# Altium project MoBo.PrjPcb
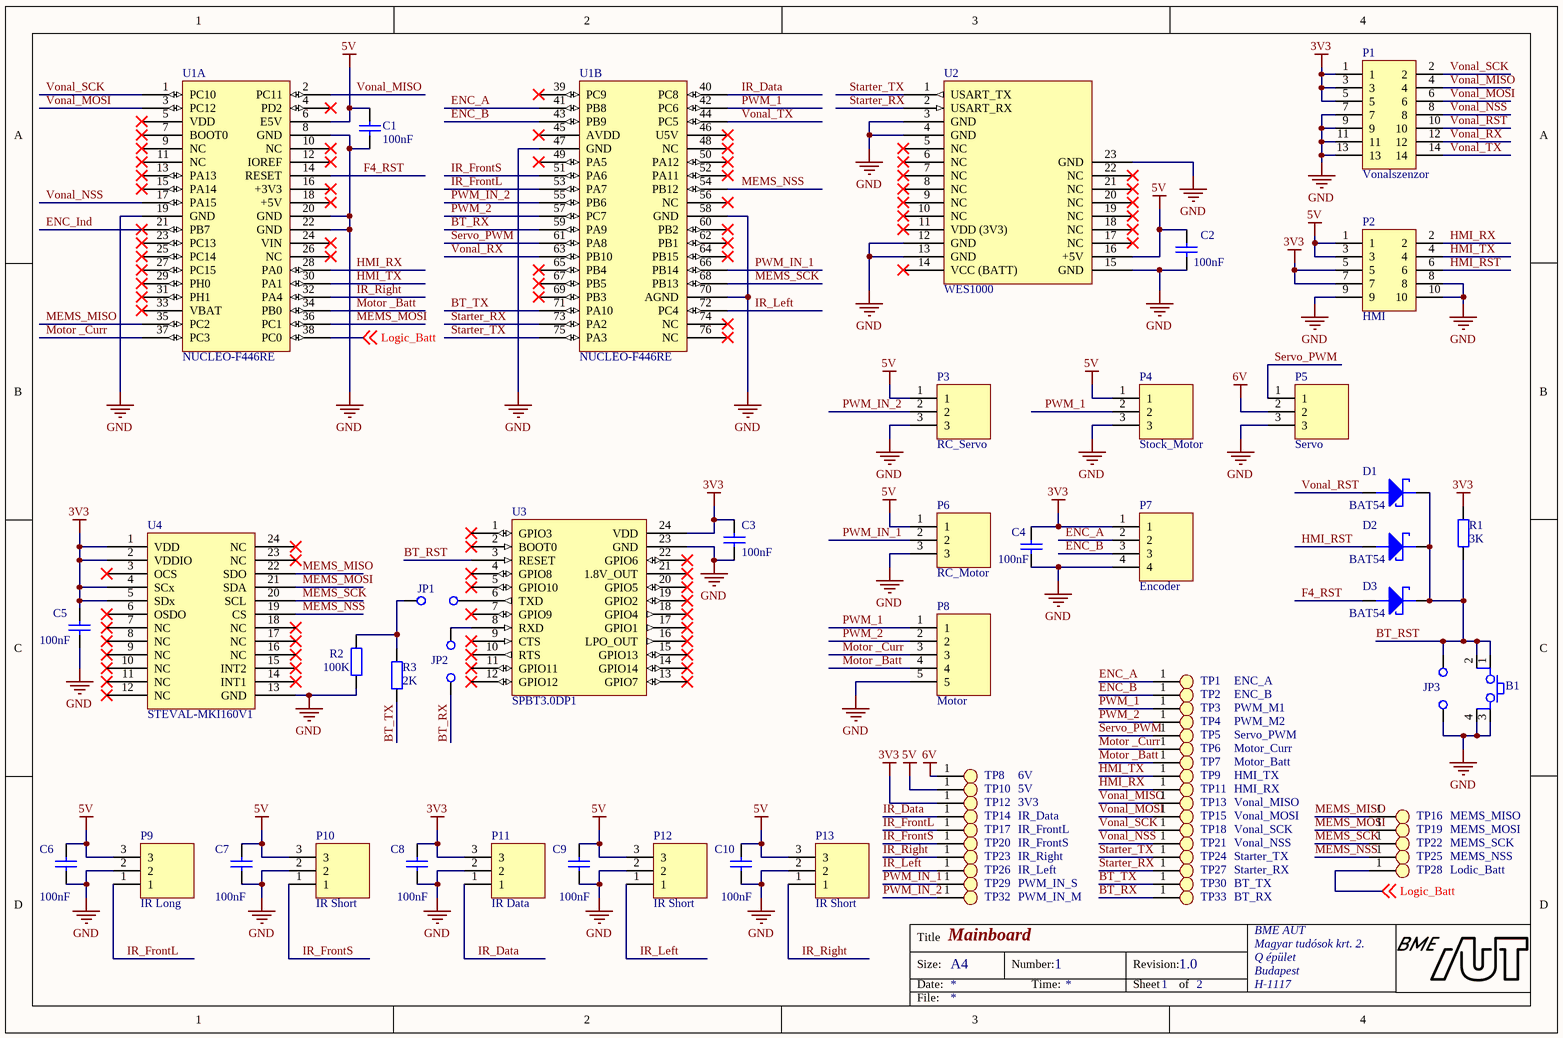
[diagram p0: MainBoard.SchDoc]
2 sheets, 101 parts. Net scope: global (net labels, ports and power ports of the same name join across sheets).
Board file: MainBoard.PcbDoc
Sheets:
  MainBoard.SchDoc
  PSU.SchDoc

## Sheet MainBoard.SchDoc: Mainboard
size A4; Organization: BME AUT; Address1: Magyar tudósok krt. 2.; Address2: Q épület; Address3: Budapest; Address4: H-1117; DocumentNumber: 1; Revision: 1.0; SheetNumber: 1; SheetTotal: 2

### Parts
B1  Button  [FP_BTN_SMD]  (value not drawn)
C1  100nF  [FP_0805_CAP_085]
C2  100nF  [FP_0805_CAP_085]
C3  100nF  [FP_0805_CAP_085]
C4  100nF  [FP_0805_CAP_085]
C5  100nF  [FP_0805_CAP_085]
C6  100nF  [FP_0805_CAP_085]
C7  100nF  [FP_0805_CAP_085]
C8  100nF  [FP_0805_CAP_085]
C9  100nF  [FP_0805_CAP_085]
C10  100nF  [FP_0805_CAP_085]
D1  BAT54  [FP_SOT23-3]
D2  BAT54  [FP_SOT23-3]
D3  BAT54  [FP_SOT23-3]
JP1  (no value)  [FP_CONN2_TUSKE_254MM]
JP2  (no value)  [FP_CONN2_TUSKE_254MM]
JP3  (no value)  [FP_CONN2_TUSKE_254MM]
P1  Vonalszenzor  [FP_CONN14]
P2  HMI  [FP_CONN10]
P3  RC_Servo  [FP_CONN3_TUSKE_254MM]
P4  Stock_Motor  [FP_CONN3_TUSKE_254MM]
P5  Servo  [FP_CONN3_TUSKE_254MM]
P6  RC_Motor  [FP_CONN3_TUSKE_254MM]
P7  Encoder  [FP_CONN4_TUSKE_254MM]
P8  Motor  [FP_CONN5_TUSKE_254MM]
P9  IR Long  [FP_CONN3_TUSKE_254MM]
P10  IR Short  [FP_CONN3_TUSKE_254MM]
P11  IR Data  [FP_CONN3_TUSKE_254MM]
P12  IR Short  [FP_CONN3_TUSKE_254MM]
P13  IR Short  [FP_CONN3_TUSKE_254MM]
R1  3K  [FP_0805_RES]
R2  100K  [FP_0805_RES]
R3  2K  [FP_0805_RES]
TP1  ENC_A  [FP_TestPoint]
TP2  ENC_B  [FP_TestPoint]
TP3  PWM_M1  [FP_TestPoint]
TP4  PWM_M2  [FP_TestPoint]
TP5  Servo_PWM  [FP_TestPoint]
TP6  Motor_Curr  [FP_TestPoint]
TP7  Motor_Batt  [FP_TestPoint]
TP8  6V  [FP_TestPoint]
TP9  HMI_TX  [FP_TestPoint]
TP10  5V  [FP_TestPoint]
TP11  HMI_RX  [FP_TestPoint]
TP12  3V3  [FP_TestPoint]
TP13  Vonal_MISO  [FP_TestPoint]
TP14  IR_Data  [FP_TestPoint]
TP15  Vonal_MOSI  [FP_TestPoint]
TP16  MEMS_MISO  [FP_TestPoint]
TP17  IR_FrontL  [FP_TestPoint]
TP18  Vonal_SCK  [FP_TestPoint]
TP19  MEMS_MOSI  [FP_TestPoint]
TP20  IR_FrontS  [FP_TestPoint]
TP21  Vonal_NSS  [FP_TestPoint]
TP22  MEMS_SCK  [FP_TestPoint]
TP23  IR_Right  [FP_TestPoint]
TP24  Starter_TX  [FP_TestPoint]
TP25  MEMS_NSS  [FP_TestPoint]
TP26  IR_Left  [FP_TestPoint]
TP27  Starter_RX  [FP_TestPoint]
TP28  Lodic_Batt  [FP_TestPoint]
TP29  PWM_IN_S  [FP_TestPoint]
TP30  BT_TX  [FP_TestPoint]
TP32  PWM_IN_M  [FP_TestPoint]
TP33  BT_RX  [FP_TestPoint]
U1  NUCLEO-F446RE  [FP_NUCLEO-64]  (parts A,B of 2)
U2  WES1000  [FP_WES1000]
U3  SPBT3.0DP1  [BLUETOOTH]
U4  STEVAL-MKI160V1  [FP_DIP24]

### Nets
3V3: C3.1 C4.1 C5.1 C8.1 P1.1 P1.3 P1.5 P2.5 P2.7 P7.1 P11.3 R1.2 TP12.1 U3.24(VDD) U4.1(VDD) U4.2(VDDIO) U4.4(SCx) U4.5(SDx)
5V: C1.2 C2.1 C6.1 C7.1 C9.1 C10.1 P2.1 P2.3 P3.1 P4.1 P6.1 P9.3 P10.3 P12.3 P13.3 TP10.1 U1.6(E5V) U2.16(+5V)
6V: P5.2 TP8.1
GND: B1.3 B1.4 C1.1 C2.2 C3.2 C4.2 C5.2 C6.2 C7.2 C8.2 C9.2 C10.2 JP3.1(C1) P1.7 P1.9 P1.11 P1.13 P2.8 P2.9 P2.10 P3.3 P4.3 P5.3 P6.3 P7.4 P8.5 P9.2 P10.2 P11.2 P12.2 P13.2 R2.1 U1.8(GND) U1.19(GND) U1.20(GND) U1.22(GND) U1.47(GND) U1.58(GND) U1.70(AGND) U2.3(GND) U2.4(GND) U2.12(GND) U2.13(GND) U2.15(GND) U2.23(GND) U3.23(GND) U4.13(GND)
BT_RST: B1.1 B1.2 D1.1(CATHODE) D2.1(CATHODE) D3.1(CATHODE) JP3.2(C2) R1.1 U3.3(RESET)
BT_RX: JP2.1(C1) TP33.1 U1.59(PA9)
BT_TX: R3.1 TP30.1 U1.71(PA10)
ENC_A: P7.2 TP1.1 U1.41(PB8)
ENC_B: P7.3 TP2.1 U1.43(PB9)
ENC_Ind: U1.21(PB7)
F4_RST: D3.2(ANODE) U1.14(RESET)
HMI_RST: D2.2(ANODE) P2.6
HMI_RX: P2.2 TP11.1 U1.28(PA0)
HMI_TX: P2.4 TP9.1 U1.30(PA1)
IR_Data: P11.1 TP14.1 U1.40(PC8)
IR_FrontL: P9.1 TP17.1 U1.53(PA7)
IR_FrontS: P10.1 TP20.1 U1.51(PA6)
IR_Left: P12.1 TP26.1 U1.72(PC4)
IR_Right: P13.1 TP23.1 U1.32(PA4)
Logic_Batt: TP28.1 U1.38(PC0) ; off-sheet Logic_Batt
MEMS_MISO: TP16.1 U1.35(PC2) U4.22(SDO)
MEMS_MOSI: TP19.1 U1.36(PC1) U4.21(SDA)
MEMS_NSS: TP25.1 U1.54(PB12) U4.19(CS)
MEMS_SCK: TP22.1 U1.68(PB13) U4.20(SCL)
Motor _Batt: P8.4 TP7.1 U1.34(PB0)
Motor _Curr: P8.3 TP6.1 U1.37(PC3)
PWM_1: P4.2 P8.1 TP3.1 U1.42(PC6)
PWM_2: P8.2 TP4.1 U1.57(PC7)
PWM_IN_1: P6.2 TP29.1 U1.66(PB14)
PWM_IN_2: P3.2 TP32.1 U1.55(PB6)
Servo_PWM: P5.1 TP5.1 U1.61(PA8)
Starter_RX: TP27.1 U1.73(PA2) U2.2(USART_RX)
Starter_TX: TP24.1 U1.75(PA3) U2.1(USART_TX)
Vonal_MISO: P1.4 TP13.1 U1.2(PC11)
Vonal_MOSI: P1.6 TP15.1 U1.3(PC12)
Vonal_NSS: P1.8 TP21.1 U1.17(PA15)
Vonal_RST: D1.2(ANODE) P1.10
Vonal_RX: P1.12 U1.63(PB10)
Vonal_SCK: P1.2 TP18.1 U1.1(PC10)
Vonal_TX: P1.14 U1.44(PC5)
NetJP1_1: JP1.1(C1) U3.6(TXD)
NetJP1_2: JP1.2(C2) R2.2 R3.2
NetJP2_2: JP2.2(C2) U3.8(RXD)

Not connected (* = marked no-connect by the designer): U1 4(PD2)* 5(VDD)* 7(BOOT0)* 9(NC)* 10(NC)* 11(NC)* 12(IOREF)* 13(PA13)* 15(PA14)* 16(+3V3)* 18(+5V)* 23(PC13)* 24(VIN)* 25(PC14)* 26(NC)* 27(PC15)* 29(PH0)* 31(PH1)* 33(VBAT)* 39(PC9)* 45(AVDD)* 46(U5V)* 48(NC)* 49(PA5)* 50(PA12)* 52(PA11)* 56(NC)* 60(PB2)* 62(PB1)* 64(PB15)* 65(PB4)* 67(PB5)* 69(PB3)* 74(NC)* 76(NC)*; U2 5(NC)* 6(NC)* 7(NC)* 8(NC)* 9(NC)* 10(NC)* 11(VDD_(3V3))* 14(VCC_(BATT))* 17(NC)* 18(NC)* 19(NC)* 20(NC)* 21(NC)* 22(NC)*; U3 1(GPIO3)* 2(BOOT0)* 4(GPIO8)* 5(GPIO10)* 7(GPIO9)* 9(CTS)* 10(RTS)* 11(GPIO11)* 12(GPIO12)* 13(GPIO7)* 14(GPIO14)* 15(GPIO13)* 16(LPO_OUT)* 17(GPIO1)* 18(GPIO4)* 19(GPIO2)* 20(GPIO5)* 21(1.8V_OUT)* 22(GPIO6)*; U4 3(OCS)* 6(OSDO)* 7(NC)* 8(NC)* 9(NC)* 10(NC)* 11(NC)* 12(NC)* 14(INT1)* 15(INT2)* 16(NC)* 17(NC)* 18(NC)* 23(NC)* 24(NC)*

### Notes on the sheet
- Title
- Size:
- Date:
- A4
- Number:
- Time:
- Revision:
- Sheet
- of
- File:

### Library data of the parts
B1 = Button 4P: Push button; Name: FSM4JSMA; Reference: 45-05-43; Supplier: Lomex
C1-C10 = CAP: Capacitor; Tolerance: 10%; Voltage: 50V; Name: 0805B104K500CT; Supplier: Lomex; Reference: 82-10-76; Value: 100nF
D1-D3 = SCHOTTKY: Schottky diode; pin to pad: 1>3 2>1; Reference: 1467516; Supplier: Farnell; Name: BAT54
JP1-JP3 = JUMPER: Jumper Wire; Supplier: Lomex; Reference: 43-10-50; Name: JUMPER
P1 = Connector_14pin: 14pin Connector; Name: SZAL.KABEL 14 P APA; Reference: 43-01-65; Supplier: Lomex
P2 = Connector_10pin: 10pin Connector; Name: SZAL.KABEL 10 P APA; Reference: 43-00-51; Supplier: Lomex
P3-P6 P9-P13 = Connector_3pin: 3pin connector
P7 = Connector_4pin: 4pin Connector
P8 = Connector_5pin: 5pin Connector
R1 = RES: Resistor; Tolerance: 5%; Power: 1/8W; Name: CR-05JL7----3K; Supplier: Lomex; Reference: 81-11-91; Value: 3K
R2 = RES: Resistor; Tolerance: 5%; Power: 1/8W; Name: CR-05JL7--100K; Supplier: Lomex; Reference: 81-11-11; Value: 100K
R3 = RES: Resistor; Tolerance: 5%; Power: 1/8W; Name: CR-05JL7----2K; Supplier: Lomex; Reference: 81-11-90; Value: 2K
TP1-TP30 TP32 TP33 = TestPoint: Test Point
U1 = NUCLEO-F446RE: Reference: NUCLEO; Name: Nucleo F446RE; Supplier: Tanszék
U2 = WES1000: SiLabs vezeték nélküli modul
U3 = SPBT3.0DP1: Bluetooth 3.0 modul
U4 = STEVAL-MKI160V1: Inierciális modul

## Sheet PSU.SchDoc: Power supply
size A4; Organization: BME AUT; Address1: Magyar tudósok krt. 2.; Address2: Q épület; Address3: Budapest; Address4: H-1117; DocumentNumber: 1; Revision: 1.0; SheetNumber: 2; SheetTotal: 3
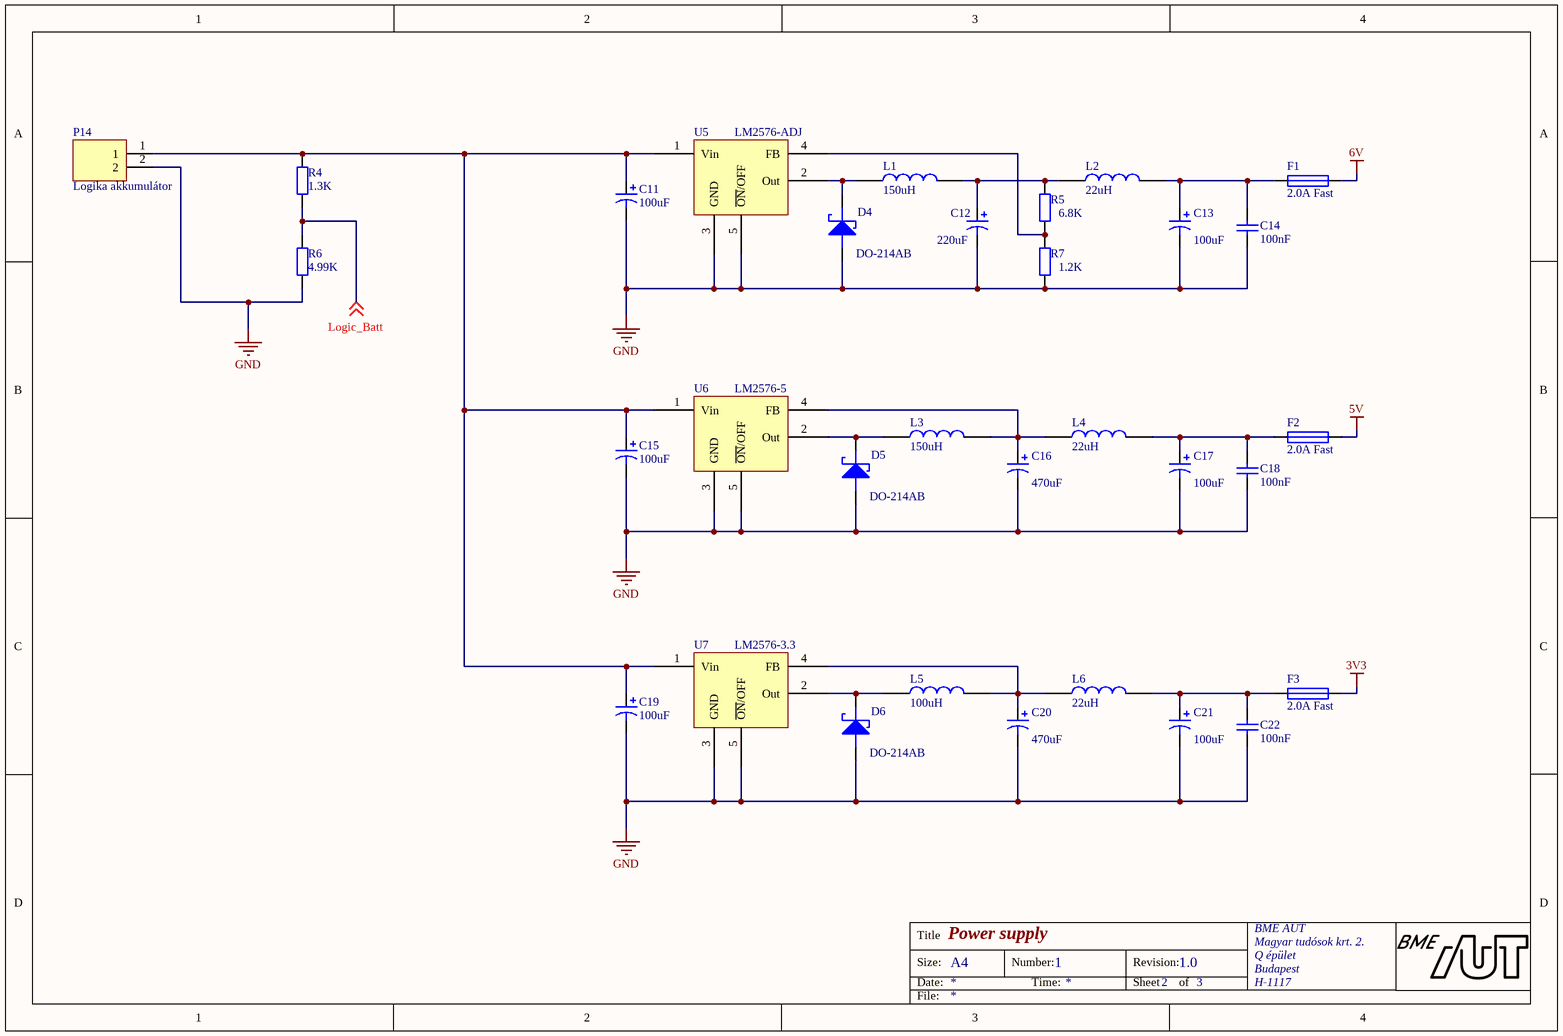
[diagram p1: PSU.SchDoc]

### Parts
C11  100uF  [FP_CAP_ELKO_6,3X6,3]
C12  220uF  [FP_CAP_ELKO_6,3X6,3]
C13  100uF  [FP_CAP_ELKO_6,3X6,3]
C14  100nF  [FP_0805_CAP_085]
C15  100uF  [FP_CAP_ELKO_6,3X6,3]
C16  470uF  [FP_CAP_ELKO_6,3X6,3]
C17  100uF  [FP_CAP_ELKO_6,3X6,3]
C18  100nF  [FP_0805_CAP_085]
C19  100uF  [FP_CAP_ELKO_6,3X6,3]
C20  470uF  [FP_CAP_ELKO_6,3X6,3]
C21  100uF  [FP_CAP_ELKO_6,3X6,3]
C22  100nF  [FP_0805_CAP_085]
D4  DO-214AB  [FP_SMC]
D5  DO-214AB  [FP_SMC]
D6  DO-214AB  [FP_SMC]
F1  2.0A Fast  [FP_0805_RES]
F2  2.0A Fast  [FP_0805_RES]
F3  2.0A Fast  [FP_0805_RES]
L1  150uH  [FP_IND_12.3x12.3]
L2  22uH  [FP_IND_10x10]
L3  150uH  [FP_IND_12.3x12.3]
L4  22uH  [FP_IND_10x10]
L5  100uH  [FP_IND_12.5x12.5]
L6  22uH  [FP_IND_10x10]
P14  Logika akkumulátor  [FP_XT60]
R4  1.3K  [FP_0805_RES]
R5  6.8K  [FP_0805_RES]
R6  4.99K  [FP_0805_RES]
R7  1.2K  [FP_0805_RES]
U5  LM2576-ADJ  [FP_TO220-5]
U6  LM2576-5  [FP_TO220-5]
U7  LM2576-3.3  [FP_TO220-5]

### Nets
3V3: F3.2
5V: F2.2
6V: F1.2
GND: C11.N C12.N C13.N C14.1 C15.N C16.N C17.N C18.1 C19.N C20.N C21.N C22.1 D4.2(ANODE) D5.2(ANODE) D6.2(ANODE) P14.2 R6.1 R7.1 U5.3(GND) U5.5(~{ON}/OFF) U6.3(GND) U6.5(~{ON}/OFF) U7.3(GND) U7.5(~{ON}/OFF)
Logic_Batt: R4.1 R6.2 ; off-sheet Logic_Batt
NetC11_P: C11.P C15.P C19.P P14.1 R4.2 U5.1(Vin) U6.1(Vin) U7.1(Vin)
NetC12_P: C12.P L1.2 L2.1 R5.2
NetC13_P: C13.P C14.2 F1.1 L2.2
NetC16_P: C16.P L3.2 L4.1 U6.4(FB)
NetC17_P: C17.P C18.2 F2.1 L4.2
NetC20_P: C20.P L5.2 L6.1 U7.4(FB)
NetC21_P: C21.P C22.2 F3.1 L6.2
NetD4_1: D4.1(CATHODE) L1.1 U5.2(Out)
NetD5_1: D5.1(CATHODE) L3.1 U6.2(Out)
NetD6_1: D6.1(CATHODE) L5.1 U7.2(Out)
NetR5_1: R5.1 R7.2 U5.4(FB)

### Notes on the sheet
- Title
- Size:
- Date:
- A4
- Number:
- Time:
- Revision:
- Sheet
- of
- File:

### Library data of the parts
C11 C13 C15 C17 C19 C21 = CAP_ELECT: Polarized Capacitor; Voltage: 16V; Tolerance: 20%; Name: VSV107M016S0ANE010; Supplier: Lomex; Reference: 91-00-20; Value: 100uF
C12 = CAP_ELECT: Polarized Capacitor; Voltage: 16V; Tolerance: 20%; Name: VEV227M016S0ANE040; Supplier: Lomex; Reference: 91-00-92; Value: 220uF
C14 C18 C22 = CAP: as C1 on sheet MainBoard; Supplier: Lomex; Reference: 82-10-76; Value: 100nF
C16 C20 = CAP_ELECT: Polarized Capacitor; Voltage: 16V; Tolerance: 20%; Reference: 2612034; Name: EEETC1C101XP; Supplier: Farnell; Value: 470uF
D4-D6 = SCHOTTKY: Schottky diode; Reference: 2675142; Name: SS32+; Supplier: Farnell
F1-F3 = Fuse: Reference: 1337421; Name: MCF0805B2R00FSTR; Supplier: Farnell
L1 L3 = IND: Inductor; Imax: 1.8A; Tolerance: 10%; Reference: 2288481; Name: MSS1278-154KLD; Supplier: Farnell; Value: 150uH
L2 L4 L6 = IND: Inductor; Imax: 2.5A; Tolerance: 20%; Reference: 2360369; Name: ELLATP220MB; Supplier: Farnell; Value: 22uH
L5 = IND: Inductor; Imax: 2.1A; Tolerance: 20%; Reference: 2374166; Name: SRR1280A-101M; Supplier: Farnell; Value: 100uH
P14 = Connector_2pin: 2pin connector; Name: XT60; Supplier: külső
R4 = RES: Resistor; Tolerance: 1%; Power: 1/8W; Name: CR-05FL7---1K3; Supplier: Lomex; Reference: 80-11-95; Value: 1.3K
R5 = RES: Resistor; Tolerance: 1%; Power: 1/8W; Name: CR-05FL7---6K8; Supplier: Lomex; Reference: 80-10-96; Value: 6.8K
R6 = RES: Resistor; Tolerance: 1%; Power: 1/8W; Name: WR08X4991FTL; Supplier: Lomex; Reference: 80-37-34; Value: 4.99K
R7 = RES: Resistor; Tolerance: 1%; Power: 1/8W; Name: CR-05FL7---1K2; Supplier: Lomex; Reference: 80-10-87; Value: 1.2K
U5 = LM2576: 3-A Step-Down Voltage Regulator; Reference: 9488146; Name: LM2576-ADJ; Supplier: Farnell
U6 = LM2576: 3-A Step-Down Voltage Regulator; Name: LM2576-5.0; Reference: 1564682; Supplier: Farnell
U7 = LM2576: 3-A Step-Down Voltage Regulator; Reference: 2382916; Name: LM2576-3.3; Supplier: Farnell

## Nets that join several sheets
3V3: MainBoard (18 pins), PSU (F3.2)
5V: MainBoard (18 pins), PSU (F2.2)
6V: MainBoard (P5.2 TP8.1), PSU (F1.2)
GND: MainBoard (47 pins), PSU (24 pins)
Logic_Batt: MainBoard (TP28.1 U1.38), PSU (R4.1 R6.2)